# EAGLE design orb-4 (EAGLE 7.7.0)
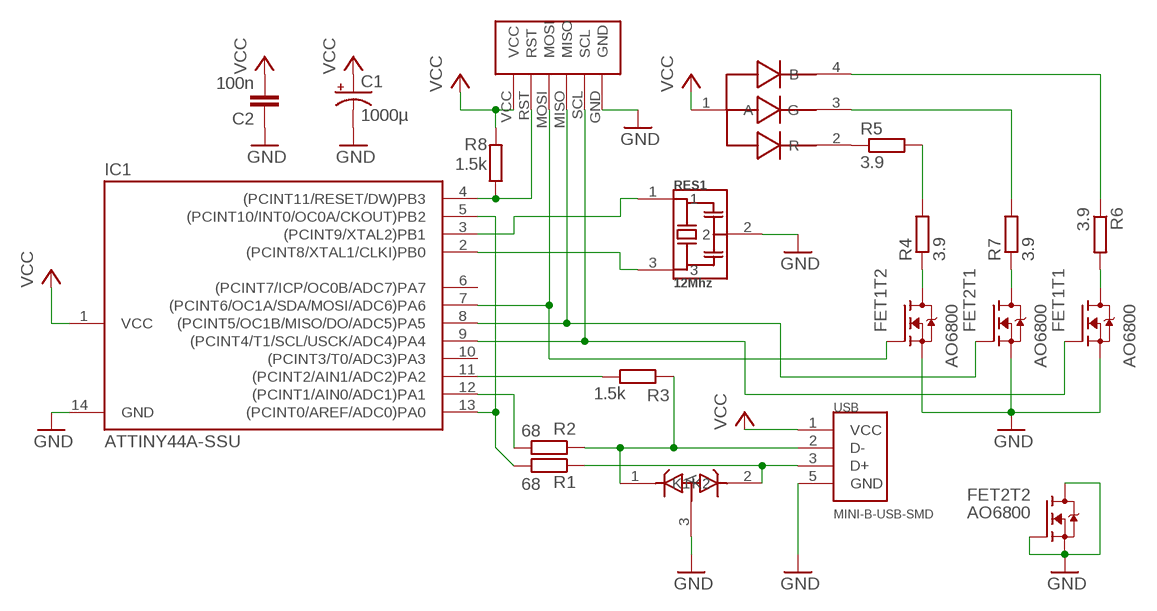
[diagram p0: schematic, sheet 1]

## Parts
C1  1000µ  CPOL-USF  [PANASONIC_F]
C2  100n  C-EUC0805K  [C0805K]
D1  3.6V  SOT23-DUAL-ZENER  [SOT23]
FET1  AO6800  [TSOP6]
FET2  AO6800  [TSOP6]
IC1  ATTINY44A-SSU  ATTINY24/44/84-SSU  [SOIC14]
R1  68  R-EU_M0805  [M0805]
R2  68  R-EU_M0805  [M0805]
R3  1.5k  R-EU_M0805  [M0805]
R4  3.9  R-EU_R2512  [R2512]
R5  3.9  R-EU_R2512  [R2512]
R6  3.9  R-EU_R2512  [R2512]
R7  3.9  R-EU_R2512  [R2512]
R8  1.5k  R-EU_M0805  [M0805]
RES1  12Mhz  RESONATOR  [AWSCR-CV]
U$1  5W-RGB  [5W-POWER-LED]
U$2  PROG-HEADER  [SMALL-PROG-HEADER]
USB  MINI-B-USB-SMD  [USB-UX60SC-SMD]

## Nets
D+: D1.2(K2) R1.1 USB.3(D+)
D-: D1.1(K1) R2.1 R3.2 USB.2(D-)
GND: C1.- C2.1 D1.3(A) FET1.2(T2:S) FET1.5(T1:S) FET2.2(T2:S) FET2.3(T2:G) FET2.4(T2:D) FET2.5(T1:S) IC1.14(GND) RES1.2 U$2.GND USB.5(GND)
N$1: IC1.2((PCINT8/XTAL1/CLKI)PB0) RES1.3
N$2: IC1.3((PCINT9/XTAL2)PB1) RES1.1
N$3: FET1.3(T2:G) IC1.7((PCINT6/OC1A/SDA/MOSI/ADC6)PA6) U$2.MOSI
N$4: IC1.11((PCINT2/AIN1/ADC2)PA2) R3.1
N$5: IC1.5((PCINT10/INT0/OC0A/CKOUT)PB2) IC1.13((PCINT0/AREF/ADC0)PA0) R1.2
N$6: IC1.12((PCINT1/AIN0/ADC1)PA1) R2.2
N$8: FET1.4(T2:D) R4.1
N$9: FET2.6(T1:D) R7.1
N$10: FET1.6(T1:D) R6.2
N$11: R5.1 U$1.2(R)
N$12: R7.2 U$1.3(G)
N$13: R6.1 U$1.4(B)
N$14: FET2.1(T1:G) IC1.8((PCINT5/OC1B/MISO/DO/ADC5)PA5) U$2.MISO
N$15: FET1.1(T1:G) IC1.9((PCINT4/T1/SCL/USCK/ADC4)PA4) U$2.SCL
N$18: R4.2 R5.2
RESET: IC1.4((PCINT11/RESET/DW)PB3) R8.1 U$2.RST
VCC: C1.+ C2.2 IC1.1(VCC) R8.2 U$1.1(A) U$2.VCC USB.1(VCC)
Unconnected: IC1.6((PCINT7/ICP/OC0B/ADC7)PA7) IC1.10((PCINT3/T0/ADC3)PA3)

## Library data of the parts
C1 = rcl:CPOL-US: POLARIZED CAPACITOR, American symbol
C2 = rcl:C-EU: CAPACITOR, European symbol
D1 = henner:SOT23-DUAL-ZENER
FET1 FET2 = henner:AO6800
IC1 = attiny24_44_84:ATTINY24/44/84
R1-R8 = resistor:R-EU_: RESISTOR, European symbol
RES1 = henner:RESONATOR
U$1 = henner:5W-RGB
U$2 = henner:PROG-HEADER
USB = henner:MINI-B-USB-SMD

## Board
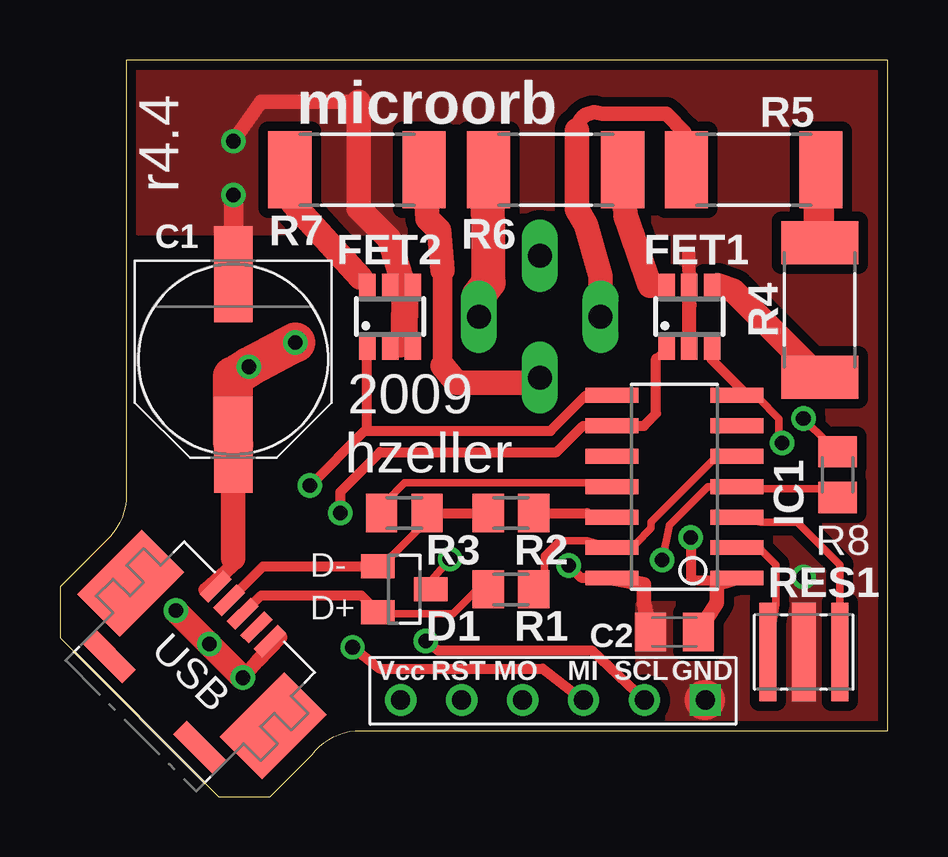
[diagram p1: board, top side]
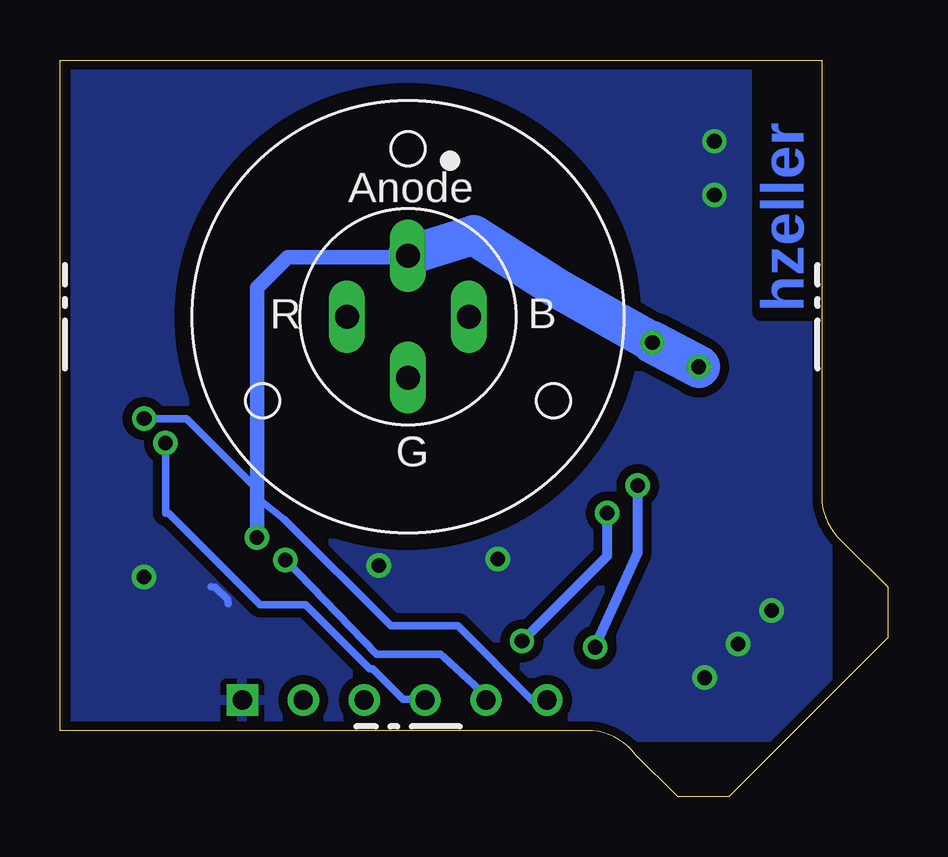
[diagram p2: board, bottom side, seen from below]

Size 34.5 x 30.69 mm. Coordinates in mm from the lower left corner, seen from the top.
Outline: 34.5,2.75 34.5,30.69 2.75,30.69 2.75,12.3 arc-45 1.76,10.51 0,8.75 0,6.61 6.61,0 8.75,0 10.51,1.76 arc-45 12.3,2.75 34.5,2.75
Copper layers (1*16): Top 0.035mm / dielectric 1.5mm / Bottom 0.035mm
Design rules "default *": minimum track width 12mil, minimum drill 24mil, track to track 12mil, track to pad 12mil, pad to pad 10mil, via to via 12mil, smd to smd 8mil, copper to edge 10mil, drill to drill 8mil, minimum pad ring 10mil, minimum via ring 8mil, stop-mask expansion 4mil, vias tented up to drill 24mil, thermal gap 10mil

### Footprints (pad centres in the part's own frame; a part is rotated, then mirrored left to right if it is on the bottom)
PANASONIC_F = smd 4 x 1.6: + 3.55,0; - -3.55,0
C0805K = smd 1.3 x 1.6: 1 -1,0; 2 1,0
SOT23 = smd 1 x 1.4: 1 -0.95,-1.1; 2 0.95,-1.1; 3 0,1.1
TSOP6 = smd 0.69 x 0.99: 1 -0.95,-1.3; 2 0,-1.3; 3 0.95,-1.3; 4 0.95,1.3; 5 0,1.3; 6 -0.95,1.3
SOIC14 = smd 0.61 x 2.21: 1 -3.81,-2.603; 2 -2.54,-2.603; 3 -1.27,-2.603; 4 0,-2.603; 5 1.27,-2.603; 6 2.54,-2.603; 7 3.81,-2.603; 8 3.81,2.603; 9 2.54,2.603; 10 1.27,2.603; 11 0,2.603; 12 -1.27,2.603; 13 -2.54,2.603; 14 -3.81,2.603
M0805 = smd 1.3 x 1.6: 1 -0.95,0; 2 0.95,0
R2512 = smd 1.8 x 3.2: 1 -2.8,0; 2 2.8,0
AWSCR-CV = smd 0.7 x 4.1: 1 -1.5,0; 3 1.5,0 | smd 1 x 4.1: 2 0,0
5W-POWER-LED = drill 1 long: 1 0,2.54; 2 -2.54,0; 3 0,-2.54; 4 2.54,0
SMALL-PROG-HEADER = drill 0.8 square: GND -6.35,0 | drill 0.8: MISO -1.27,0; MOSI 1.27,0; RST 3.81,0; SCL -3.81,0; VCC 6.35,0
USB-UX60SC-SMD = smd 0.5 x 1.4: 1 -1.6,6.1; 2 -0.8,6.1; 3 0,6.1; 4 0.8,6.1; 5 1.6,6.1 | smd 2.5 x 3.8: M1 -4.2,3.7; M2 4.2,3.7 | smd 2.35 x 0.8: M3 -2.675,0.9; M4 2.675,0.9

### Placement (x,y rotation side)
C1  7.22,18.22 270 top
C2  25.61,6.86 0 top
D1  14.36,8.64 270 top
FET1  26.24,20 0 top
FET2  13.76,20 0 top
IC1  25.61,12.91 90 top
R1  18.8,8.64 0 top
R2  18.8,11.81 0 top
R3  14.36,11.81 0 top
R4  31.67,20.28 90 top
R5  28.92,26.12 0 top
R6  20.66,26.12 0 top
R7  12.38,26.12 0 top
R8  32.41,13.42 90 top
RES1  31,6.02 180 top
U$1  20,20 0 bottom
U$2  20.55,4.02 180 top
USB  3.31,3.31 315 top

### Tracks (layer width: path | path; a pad name or v marks a point on that pad's centre or on a via)
D+
  Top 0.305: R1.1 17.28,8.51 16.39,7.62 13.85,7.62 D1.2
  Top 0.406: D1.2 12.56,8.39 8.39,8.39 USB.3
D-
  Top 0.305: R3.2 15.19,11.51 15.19,11.38 13.85,10.04 D1.1
  Top 0.406: D1.1 8.46,9.59 USB.2 | R3.2 R2.1
GND  (via drill 0.61)
  Top 0.305: 9.17,6.63 USB.5 | 26.25,20.5 26.22,20.86 FET1.5 26.27,21.21 26.24,21.11 | v16.26,9.91 15.5,9.02 D1.3 | C1.- 7.24,23.75 | 7.24,25.15 7.24,25.25
  Top 0.406: FET2.2 FET2.3 14.74,21.19 14.2,18.7 | 14.23,21.66 FET2.5 | v21.21,9.63 21.72,9.12 23.02,9.12
  Top 0.559: 26.24,21.11 26.22,22.61
  Top 0.584: FET1.2 26.25,20.5 FET1.5
  Top 0.61: C2.1 24.34,8.09 24.34,8.85 IC1.14 | 14.23,21.66 FET2.4 | 12.45,28.96 8.39,28.96 v7.22,27.31 | 9.17,6.63 8.23,5.67 v7.62,4.96
  Top 0.813: 14.2,18.7 14.23,21.66 | 7.24,23.75 7.24,25.15
  Top 1.016: v7.62,4.96 v6.23,6.35 v4.83,7.75 | 14.23,21.66 13.72,23.25 12.45,24.52 12.45,28.96
  Top 1.676: U$2.GND 26.88,4.02
  Bottom 0.305: 27.49,8.03 27.52,8.21 28.03,8.72 28.21,8.76
  other vias: 31,9.15 7.22,25.07
  pour Bottom (isolate 0.381): 2.5,30.95 33.87,30.95 33.87,2.5 2.5,2.5
  pour Top (isolate 0.406, no thermals): 34,29.8 25.61,29.8 25.61,20.66 27.08,20.58 27.08,2.98 34,3.13
  pour Top (isolate 0.406, no thermals): 3.26,30.28 3.23,23.6 33.84,23.55 33.91,30.15 3.48,30.13
  pour Top (isolate 0.406, no thermals): 24.13,8.01 33.91,8.01 33.91,3.05 24.13,3.05
N$1
  Top 0.305: RES1.3 29.85,8.01 29.85,9.66 29.21,10.29 IC1.2 28.32,10.29 29.09,10.29
N$2
  Top 0.305: IC1.3 29.21,11.43 30.74,11.43 32.52,9.66 32.52,8.01 RES1.1
N$3  (via drill 0.61)
  Top 0.305: 28.66,16.72 IC1.7 28.71,16.64 29.09,16.64 29.98,15.75 29.98,15.12 v30.1,14.74
  Top 0.406: 28.66,16.72 27.14,18.25 FET1.3
  Bottom 0.305: v30.1,14.74 30.1,11.81 29.98,11.81 26.17,8.01 24.26,8.01 21.59,5.34 21.47,5.34 20.2,4.07 19.31,4.07 U$2.MOSI
N$4
  Top 0.305: R3.1 13.59,12.17 13.59,12.3 14.36,13.09 21.98,13.09 IC1.11
N$5
  Top 0.305: IC1.5 27.18,13.97 24.64,11.43 24.64,11.18 24.01,10.54 IC1.13 21.98,10.67 20.83,10.67 20.2,10.04 20.2,9.4 R1.2 19.56,9.28 19.54,9.15
N$6
  Top 0.305: 21.98,11.81 IC1.12
  Top 0.406: R2.2 21.98,11.81
N$8
  Top 0.305: 27.41,21.32 FET1.4
  Top 1.016: 27.41,21.32 28.07,21.09 R4.1
N$9
  Top 0.406: 12.54,21.61 FET2.6
  Top 1.016: R7.1 9.72,24.71 12.54,21.61
N$10
  Top 0.508: 24.83,21.07 FET1.6
  Top 0.61: 24.6,21.3 24.83,21.07
  Top 1.016: 24.6,21.3 23.58,24.22 R6.2
N$11
  Top 0.305: 26.04,27.69 R5.1
  Top 0.61: 21.55,27.77 arc-90 22.31,28.51 22.61,28.45 25.28,28.45 26.04,27.69
  Top 1.016: U$1.2 22.54,21.7 21.93,23.84 21.55,24.47 21.55,27.77
N$12
  Top 0.813: 15.95,17.96 15.95,21.92
  Top 1.016: R7.2 15.32,24.08 15.8,23.6 15.95,21.92 | 15.95,17.96 16.54,17.25 19.79,17.25 U$1.3
N$13
  Top 0.61: 17.84,26.9 R6.1
  Top 1.422: U$1.4 17.46,20.89 17.87,21.42 17.84,26.9
N$14  (via drill 0.61)
  Top 0.305: IC1.8 23.33,16.72 | 12.81,18.29 FET2.1 | 12.7,15.24 12.81,15.37
  Top 0.406: U$2.MISO 20.13,5.34 13.34,5.34 v12.2,6.23 | IC1.8 21.93,16.72 20.45,15.24 12.7,15.24 v10.42,12.96 | 12.81,15.37 12.81,18.29
  Bottom 0.406: v12.2,6.23 10.42,10.16 v10.42,12.96
N$15  (via drill 0.61)
  Top 0.305: 24.85,18.25 FET1.1 | 23.5,15.45 IC1.9
  Top 0.406: 24.85,18.25 24.85,15.96 24.34,15.45 23.5,15.45 21.8,15.45 20.7,14.36 13.34,14.36 11.69,12.7 v11.69,11.81 | U$2.SCL 22.16,6.1 15.75,6.1 v15.24,6.48
  Bottom 0.406: v15.24,6.48 11.69,10.04 v11.69,11.81
N$18
  Top 1.27: R4.2 31.63,23.88 31.63,24.64 R5.2
RESET  (via drill 0.61)
  Top 0.305: v25.11,9.87 25.4,11.31 27.01,12.91 IC1.4 28.32,12.83 32.39,12.83 R8.1
  Bottom 0.305: v25.11,9.87 21.3,5.93 18.63,5.93 18.5,5.8 16.98,4.41 U$2.RST
VCC  (via drill 0.61)
  Top 0.305: USB.1 6.08,8.62 | 27.22,9.02 27.39,8.85 | v30.99,15.75 32.01,14.74 32.39,14.74 R8.2
  Top 0.406: 7.37,15.37 7.37,9.78 7.22,9.93 | 27.22,9.02 26.29,9.02 v26.29,10.8
  Top 0.61: C2.2 27.39,8.09 27.39,8.85 IC1.1 | 6.08,8.62 7.37,9.78
  Top 1.016: 7.22,9.93 C1.+
  Top 1.676: C1.+ 7.22,16.95 7.22,17.5 v7.88,17.91 v9.81,18.93
  Bottom 0.305: U$2.VCC 14.82,4.02 17.91,7.12 20.7,7.12 25.15,11.56 26.29,12.45 | U$1.1 20.06,22.48 | v30.99,15.75 29.21,15.75 26.55,13.09 26.29,13.09
  Bottom 0.61: v26.29,10.8 26.29,12.45 26.29,13.09 26.29,21.21 25.02,22.48 20.06,22.48
  Bottom 1.676: v9.81,18.93 13.79,21.19 17.25,23.4 U$1.1
  Bottom 1.778: v7.88,17.91 v9.81,18.93

### Text on the board
Bottom: hzeller
tPlace: microorb | r4.4 | 2009 | hzeller | D- | D+
Measures: . | 1250 mil / 31.75 mm | 1358 mil / 34.5 mm | 1100 mil / 27.9 mm | 1208 mil / 30.7 mm
Document: mouse-bites | Gerber files for two layers | *-sol-bot-copper.grb.sol : Copper bottom | *-sol-bot-stop.grb.sts : Stop bottom | *-sol-bot-silk.grb.pls : Silkscreen bottom | *-cmp-top-copper.grb.cmp : Copper top | *-cmp-top-stop.grb.stc : Stop top | mouse-bites | *-cmp-top-silk.grb.plc : Silkscreen top | *.drd : Drill diameters + positions | Panelization: Check with GEA about board size | Material: regular FR4, 35µm; HASL finish | Soldermask: black or blue (if possible) | mouse-bites | mouse-bites | Possible mouse-bite positions marked